# EAGLE schematic detector328p-pu (EAGLE 7.6.0)

## Sheet 1 of 2
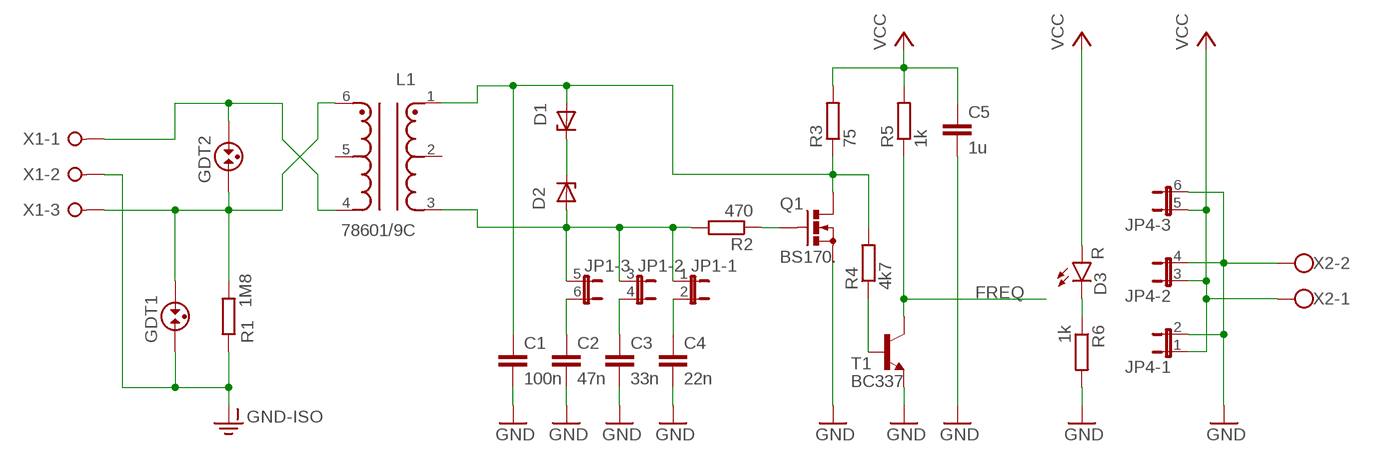
[diagram p0: schematic, sheet 1]

### Parts
C1  100n  C-EU025-025X050  [C025-025X050]
C2  47n  C-EU025-025X050  [C025-025X050]
C3  33n  C-EU025-025X050  [C025-025X050]
C4  22n  C-EU025-025X050  [C025-025X050]
C5  1u  C-EU025-030X050  [C025-030X050]
D1  24V  ZENER-DIODEZD-5  [ZDIO-5]
D2  24V  ZENER-DIODEZD-5  [ZDIO-5]
D3  R  LED3MM  [LED3MM]
GDT1  GDT-CG5350L  [CG5350L]
GDT2  GDT-CG5350L  [CG5350L]
JP1  JP3QE  [JP3Q]
JP4  JP3QE  [JP3Q]
L1  78601/9C  [78601/9C]
Q1  BS170.  [TO92-DGS]
R1  1M8  R-EU_0204/5  [0204/5]
R2  470  R-EU_0204/5  [0204/5]
R3  75  R-EU_0204/7  [0204/7]
R4  4k7  R-EU_0204/5  [0204/5]
R5  1k  R-EU_0204/5  [0204/5]
R6  1k  R-EU_0204/5  [0204/5]
T1  BC337  BC337-NPN-TO92-CBE  [TO92-CBE]
X1  W237-03P  [W237-133]
X2  W237-102  [W237-102]

### Nets
FREQ: R5.1 T1.C ; also sheet 2
GND: C1.2 C2.2 C3.2 C4.2 C5.2 JP4.2 JP4.4 JP4.6 Q1.S R6.2 T1.E X2.2 ; also sheet 2
GND-ISO: GDT1.1 R1.1 X1.2
N$1: D1.C D2.C
N$2: R4.1 T1.B
N$3: Q1.G R2.1
N$4: C3.1 JP1.4
N$5: C4.1 JP1.2
N$6: D2.A JP1.1 JP1.3 JP1.5 L1.3 R2.2
N$7: GDT2.2 L1.4 X1.1
N$11: C2.1 JP1.6
N$14: C1.1 D1.A L1.1 Q1.D R3.1 R4.2
N$22: D3.K(C) R6.1
N$47: GDT1.2 GDT2.1 L1.6 R1.2 X1.3
VCC: C5.1 D3.A JP4.1 JP4.3 JP4.5 R3.2 R5.2 X2.1 ; also sheet 2
Unconnected: L1.2 L1.5

## Sheet 2 of 2
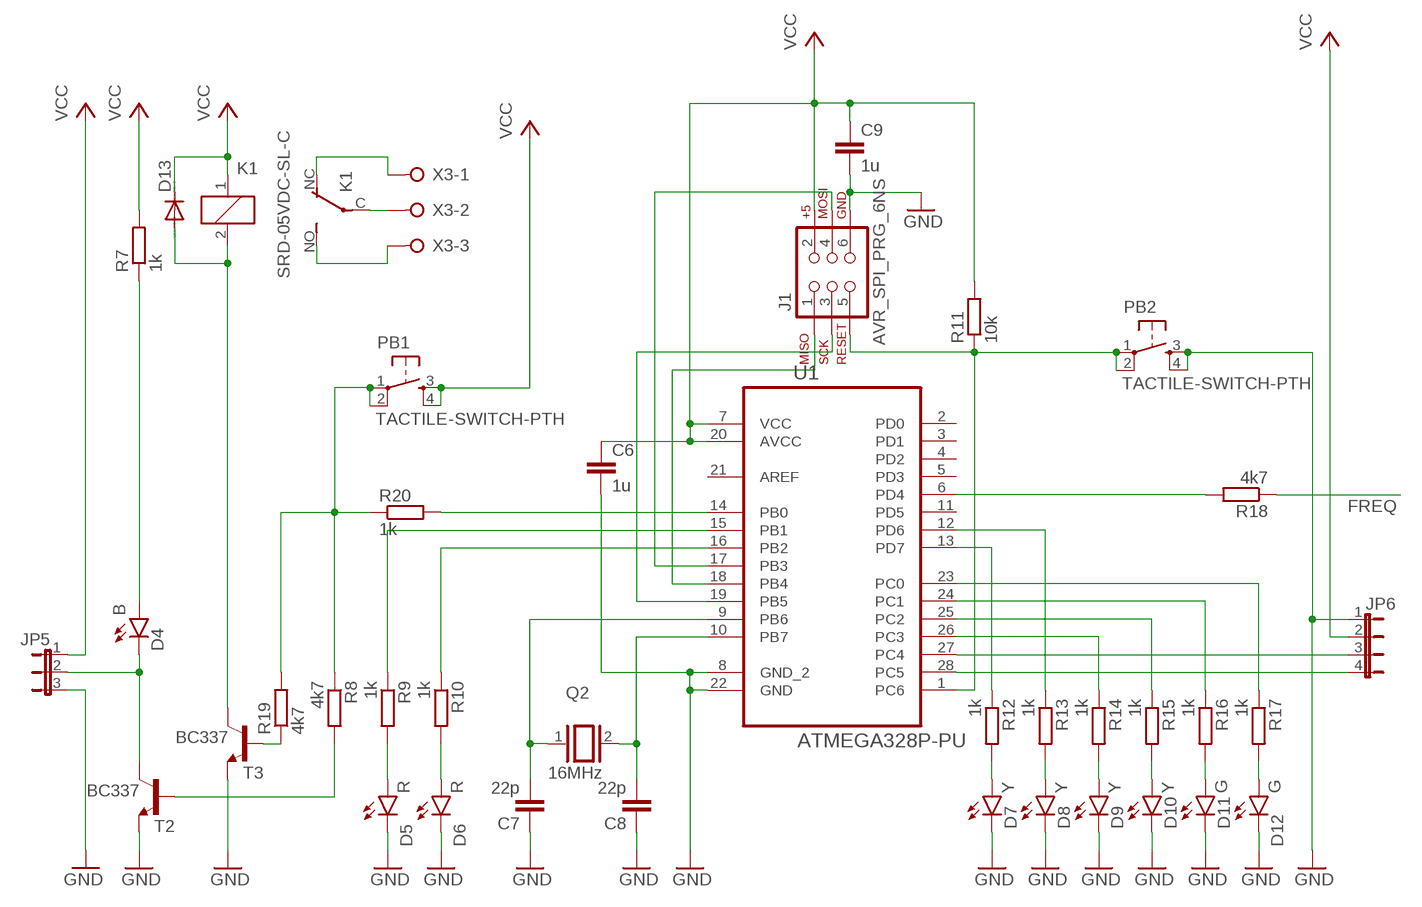
[diagram p1: schematic, sheet 2]

### Parts
C6  1u  C-EU025-030X050  [C025-030X050]
C7  22p  C-EU025-025X050  [C025-025X050]
C8  22p  C-EU025-025X050  [C025-025X050]
C9  1u  C-EU025-030X050  [C025-030X050]
D4  B  LED3MM  [LED3MM]
D5  R  LED3MM  [LED3MM]
D6  R  LED3MM  [LED3MM]
D7  Y  LED3MM  [LED3MM]
D8  Y  LED3MM  [LED3MM]
D9  Y  LED3MM  [LED3MM]
D10  Y  LED3MM  [LED3MM]
D11  G  LED3MM  [LED3MM]
D12  G  LED3MM  [LED3MM]
D13  DIODE-D-5  [D-5]
J1  AVR_SPI_PRG_6NS  [2X3-NS]
JP5  JP2E  [JP2]
JP6  JP4E  [JP4]
K1  SRD-05VDC-SL-C  [JS-M]
PB1  TACTILE-SWITCH-PTH  [TAC-SWITCH-PTH]
PB2  TACTILE-SWITCH-PTH  [TAC-SWITCH-PTH]
Q2  16MHz  XTAL/S  [QS]
R7  1k  R-EU_0204/5  [0204/5]
R8  4k7  R-EU_0204/5  [0204/5]
R9  1k  R-EU_0204/5  [0204/5]
R10  1k  R-EU_0204/5  [0204/5]
R11  10k  R-EU_0204/5  [0204/5]
R12  1k  R-EU_0204/5  [0204/5]
R13  1k  R-EU_0204/5  [0204/5]
R14  1k  R-EU_0204/5  [0204/5]
R15  1k  R-EU_0204/5  [0204/5]
R16  1k  R-EU_0204/5  [0204/5]
R17  1k  R-EU_0204/5  [0204/5]
R18  4k7  R-EU_0204/5  [0204/5]
R19  4k7  R-EU_0204/5  [0204/5]
R20  1k  R-EU_0204/5  [0204/5]
T2  BC337  BC337-NPN-TO92-CBE  [TO92-CBE]
T3  BC337  BC337-NPN-TO92-CBE  [TO92-CBE]
U1  ATMEGA328P-PU  [DIP254P762X457-28]
X3  W237-03P  [W237-133]

### Nets
FREQ: R18.1 ; also sheet 1
GND: C6.2 C7.1 C8.1 C9.2 D5.K(C) D6.K(C) D7.K(C) D8.K(C) D9.K(C) D10.K(C) D11.K(C) D12.K(C) J1.6 JP5.3 JP6.1 PB2.3 PB2.4 T2.E T3.E U1.8(GND_2) U1.22(GND) ; also sheet 1
N$8: C7.2 Q2.1 U1.9(PB6)
N$9: R18.2 U1.6(PD4)
N$10: C8.2 Q2.2 U1.10(PB7)
N$12: J1.1 U1.18(PB4)
N$13: J1.4 U1.17(PB3)
N$15: J1.3 U1.19(PB5)
N$16: D8.A R13.2
N$17: D9.A R14.2
N$18: D10.A R15.2
N$19: D11.A R16.2
N$20: R8.2 T2.B
N$21: R20.2 U1.14(PB0)
N$23: D4.K(C) JP5.2 T2.C
N$24: D4.A R7.1
N$25: R13.1 U1.12(PD6)
N$26: R12.1 U1.13(PD7)
N$27: D7.A R12.2
N$28: R14.1 U1.26(PC3)
N$29: R15.1 U1.25(PC2)
N$30: JP6.4 U1.28(PC5)
N$31: R16.1 U1.24(PC1)
N$32: D12.A R17.2
N$33: R17.1 U1.23(PC0)
N$34: D6.A R10.2
N$35: D5.A R9.2
N$36: R10.1 U1.16(PB2)
N$37: R9.1 U1.15(PB1)
N$38: PB1.1 PB1.2 R8.1 R19.2 R20.1
N$39: D13.A K1.2 T3.C
N$40: R19.1 T3.B
N$41: K1.NC(2:O) X3.1
N$42: K1.NO(2:S) X3.3
N$43: K1.C(2:P) X3.2
N$44: J1.5 PB2.1 PB2.2 R11.1 U1.1(PC6)
N$45: JP6.3 U1.27(PC4)
VCC: C6.1 C9.1 D13.C J1.2 JP5.1 JP6.2 K1.1 PB1.3 PB1.4 R7.2 R11.2 U1.7(VCC) U1.20(AVCC) ; also sheet 1
Unconnected: U1.2(PD0) U1.3(PD1) U1.4(PD2) U1.5(PD3) U1.11(PD5) U1.21(AREF)

## Library data of the parts
C1-C4 C7 C8 = resistor:C-EU: CAPACITOR, European symbol
C5 C6 C9 = rcl:C-EU: CAPACITOR, European symbol
D1 D2 = diode:ZENER-DIODE: Z-Diode
D3-D12 = SparkFun-LED:LED: LEDs Standard schematic elements and footprints for 5mm, 3mm, 1206, and 0603 sized LEDs. 5mm - Spark Fun Electronics SKU : COM-00529 (and others); PROD_ID: DIO-08794
D13 = diode:DIODE-: DIODE
GDT1 GDT2 = supressor:GDT-: GAS DISCHARGE TUBE
J1 = SparkFun-Connectors:AVR_SPI_PRG_6: AVR ISP 6 Pin This is the reduced ISP connector for AVR programming. Common on Arduino. This footprint will take up less PCB space and can be used with a 10-pin to 6-pin adapter such as SKU: BOB-08508 **Special note about "TEST_POINT" package. The stop mask is on the top side, so if you want your programming test points to be on the bottom of your board, make sure to place this package on the bottom side of the board. This also ensure that the orientation to program from the bottom side will be correct.
JP1 JP4 = jumper:JP3QE: JUMPER
JP5 = jumper:JP2E: JUMPER
JP6 = jumper:JP4E: JUMPER
K1 = detector:SRD-*-SL-C: Ultra-Miniature Power Relay
L1 = detector:78601/9C: MuRata 78601/9C
PB1 PB2 = GeekAmmo:TACTILE-SWITCH: Tactile Switch 4 Pins, SPST NO
Q1 = detector:BS170: N-CHANNEL MOS FET
Q2 = special:XTAL/S: CRYSTAL
R1-R20 = resistor:R-EU_: RESISTOR, European symbol
T1-T3 = transistor:*-NPN-: NPN Transistror BF959 corrected 2008.03.06
U1 = Atmel_By_element14_Batch_1-00:ATMEGA328P-PU: 8-bit Microcontroller with In-System Programmable Flash; MPN: ATMEGA328P-PU; OC_FARNELL: 1715487; OC_NEWARK: 15R0268; PACKAGE: PDIP-28; SUPPLIER: Atmel
X1 X3 = con-wago-508:W237-03P: WAGO SREW CLAMP; OC_FARNELL: unknown; OC_NEWARK: unknown
X2 = con-wago-500:W237-102: WAGO SCREW CLAMP; MPN: 237-102; OC_FARNELL: unknown; OC_NEWARK: 70K9898

## Net classes
0 default: width 0.305 mm